# Altium schematic sheet Power_Supply.SCHDOC: Power Supply
size A3; ApprovedBy: zac1; Author: mmb1; DrawnBy: mmb1; Engineer: mmb1; Organization: Berne University of Applied Sciences; Address1: School of Engineering and; Address2: Information Technology; Address3: Quellgasse 21; Address4: CH-2501 Biel; Revision: 1.0; SheetNumber: 3; SheetTotal: 6
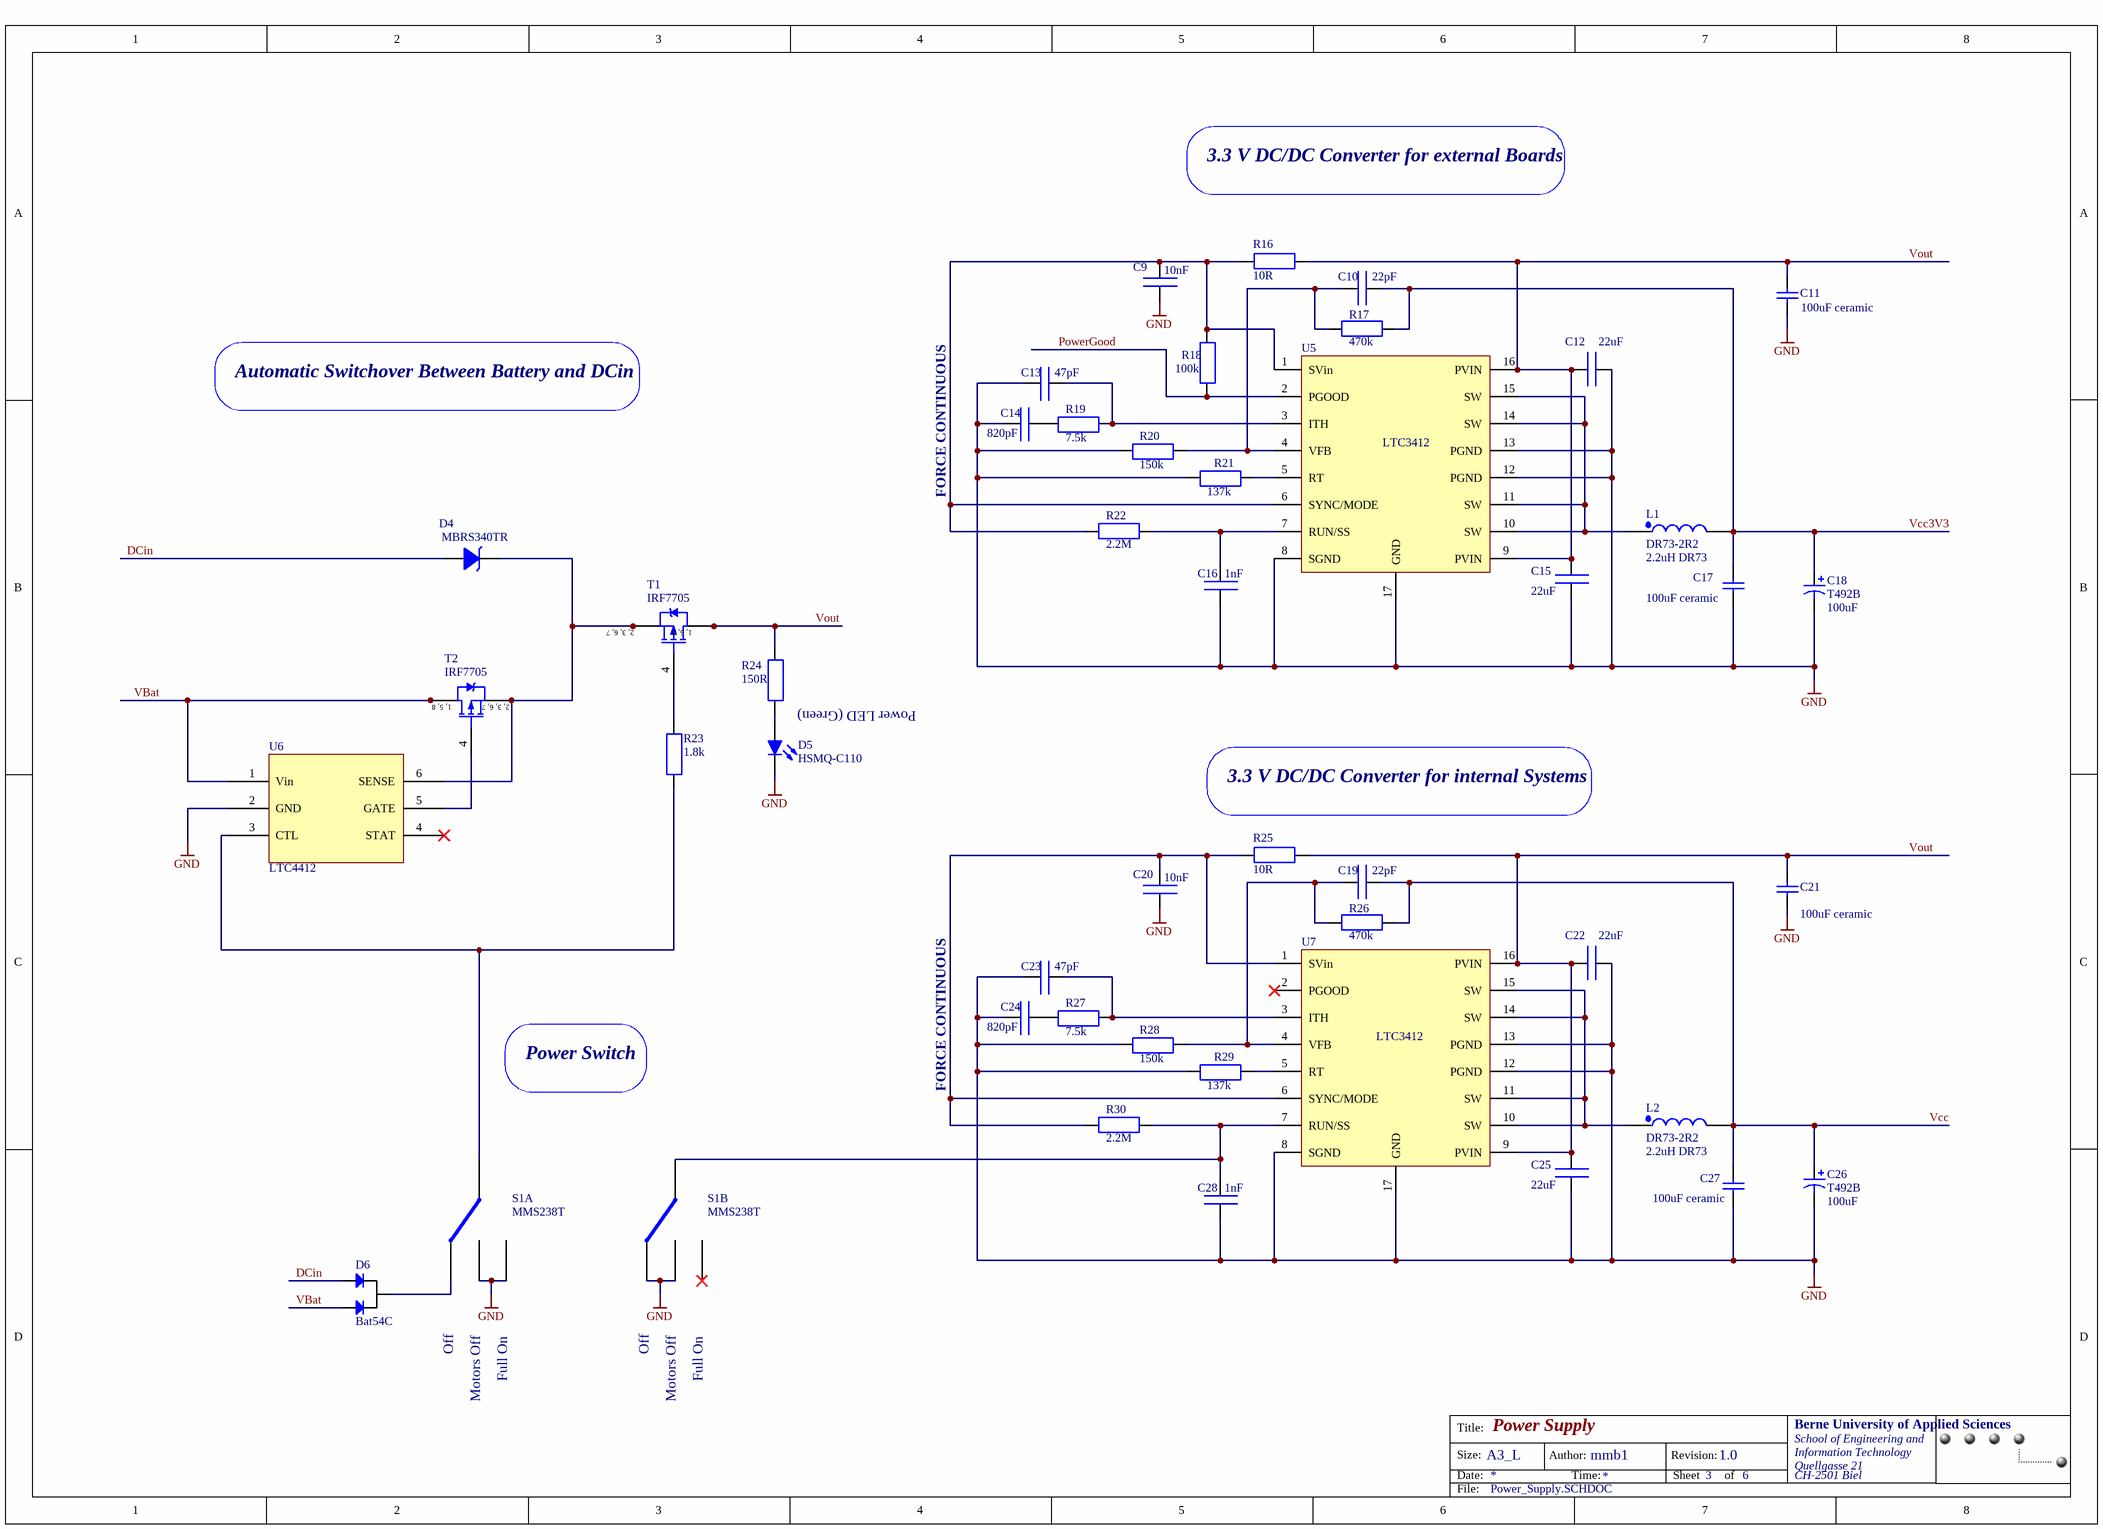
[diagram p0: Power_Supply.SCHDOC]

## Parts
C9  10nF  [1608[0603]]
C10  22pF  [1608[0603]]
C11  value 100uF ceramic  [C1210]  (hidden comment: Cap Semi)
C12  22uF  [C0805]
C13  47pF  [1608[0603]]
C14  820pF  [1608[0603]]
C15  22uF  [C0805]
C16  1nF  [1608[0603]]
C17  value 100uF ceramic  [C1210]  (hidden comment: Cap Semi)
C18  T492B  value 100uF  [B]
C19  22pF  [1608[0603]]
C20  10nF  [1608[0603]]
C21  value 100uF ceramic  [C1210]  (hidden comment: Cap Semi)
C22  22uF  [C0805]
C23  47pF  [1608[0603]]
C24  820pF  [1608[0603]]
C25  22uF  [C0805]
C26  T492B  value 100uF  [B]
C27  value 100uF ceramic  [C1210]  (hidden comment: Cap Semi)
C28  1nF  [1608[0603]]
D4  value MBRS340TR  [MBRS340]  (hidden comment: Schottky  Power Rectifier)
D5  HSMQ-C110  [HSMC-C110]
D6  Bat54C  [BAT54C]
L1  value 2.2uH DR73  [B82472G4222M]  (hidden comment: DR73-2R2)
L2  value 2.2uH DR73  [B82472G4222M]  (hidden comment: DR73-2R2)
R16  10R  [1608[0603]]
R17  470k  [1608[0603]]
R18  100k  [1608[0603]]
R19  7.5k  [1608[0603]]
R20  150k  [1608[0603]]
R21  137k  [1608[0603]]
R22  2.2M  [1608[0603]]
R23  1.8k  [1608[0603]]
R24  150R  [1608[0603]]
R25  10R  [1608[0603]]
R26  470k  [1608[0603]]
R27  7.5k  [1608[0603]]
R28  150k  [1608[0603]]
R29  137k  [1608[0603]]
R30  2.2M  [1608[0603]]
S1  MMS238T  [switch_mms238t]  (parts A,B of 2)
T1  IRF7705  [TSSOP-8]
T2  IRF7705  [TSSOP-8]
U5  LTC3412  [LCT3412A_New]
U6  LTC4412  [MAX5467]
U7  LTC3412  [LCT3412A_New]

## Nets
GND: C9.1(J1) C11.1 C12.1(J1) C13.1(J1) C14.1(J1) C15.1(J1) C16.1(J1) C17.1 C18.2 C20.1(J1) C21.1 C22.1(J1) C23.1(J1) C24.1(J1) C25.1(J1) C26.2 C27.1 C28.1(J1) D5.1(K) R20.1(J1) R21.1(J1) R28.1(J1) R29.1(J1) S1.3 S1.4 S1.6 S1.8 U5.8(SGND) U5.12(PGND) U5.13(PGND) U5.17(GND) U6.2(GND) U7.8(SGND) U7.12(PGND) U7.13(PGND) U7.17(GND)
DCin: D4.1(Anode) D6.2(A)
PowerGood: R18.1(J1) U5.2(PGOOD)
VBat: D6.1(A) T2.1(D) T2.5(D) T2.8(D) U6.1(Vin)
Vcc: C19.1(J1) C26.1 C27.2 L2.2 R26.1(J1)
Vcc3V3: C10.1(J1) C17.2 C18.1 L1.2 R17.1(J1)
Vout: C11.2 C12.2(J2) C15.2(J2) C21.2 C22.2(J2) C25.2(J2) R16.1(J1) R24.2(J2) R25.1(J1) T1.1(D) T1.5(D) T1.8(D) U5.9(PVIN) U5.16(PVIN) U7.9(PVIN) U7.16(PVIN)
NetC9_2: C9.2(J2) R16.2(J2) R18.2(J2) R22.2(J2) U5.1(SVin) U5.6(SYNC/MODE)
NetC10_2: C10.2(J2) R17.2(J2) R20.2(J2) U5.4(VFB)
NetC13_2: C13.2(J2) R19.2(J2) U5.3(ITH)
NetC14_2: C14.2(J2) R19.1(J1)
NetC16_2: C16.2(J2) R22.1(J1) U5.7(RUN/SS)
NetC19_2: C19.2(J2) R26.2(J2) R28.2(J2) U7.4(VFB)
NetC20_2: C20.2(J2) R25.2(J2) R30.2(J2) U7.1(SVin) U7.6(SYNC/MODE)
NetC23_2: C23.2(J2) R27.2(J2) U7.3(ITH)
NetC24_2: C24.2(J2) R27.1(J1)
NetC28_2: C28.2(J2) R30.1(J1) S1.7 U7.7(RUN/SS)
NetD4_2: D4.2(Cathode) T1.2(S) T1.3(S) T1.6(S) T1.7(S) T2.2(S) T2.3(S) T2.6(S) T2.7(S) U6.6(SENSE)
NetD5_2: D5.2(A) R24.1(J1)
NetD6_3: D6.3(K) S1.1
NetL1_1: L1.1 U5.10(SW) U5.11(SW) U5.14(SW) U5.15(SW)
NetL2_1: L2.1 U7.10(SW) U7.11(SW) U7.14(SW) U7.15(SW)
NetR21_2: R21.2(J2) U5.5(RT)
NetR23_1: R23.1(J1) S1.2 U6.3(CTL)
NetR23_2: R23.2(J2) T1.4(G)
NetR29_2: R29.2(J2) U7.5(RT)
NetT2_4: T2.4(G) U6.5(GATE)

Not connected (* = marked no-connect by the designer): S1 5*; U6 4(STAT)*; U7 2(PGOOD)*

## Notes on the sheet
- 3.3 V DC/DC Converter for external Boards
- Automatic Switchover Between Battery and DCin
- FORCE CONTINUOUS
- Power LED (Green)
- 3.3 V DC/DC Converter for internal Systems
- Power Switch
- Off
- Motors Off
- Full On
- Title:
- Size:
- Date:
- A3_L
- Author:
- Time:
- Revision:
- Sheet
- of
- File:
- (in symbol IRF7705) 1, 5, 8; 2, 3, 6, 7

## Library data of the parts
C9 C20 = CAP: Capacitor; Manufacturer: AVX; Part Number: 06035C103KAT2A; Value: 10nF 0603; Currency: CHF; Packaging unit: 10; Part Type: 10nF; Distributor: Farnell; Distributor Number: 1327 675; Price: 0.07; RoHS: yes
C10 C19 = CAP: Capacitor; Manufacturer: Epcos; Part Number: B37930K5220J60; Value: 22pF 0603; Currency: CHF; Packaging unit: 10; Part Type: 22pF; Distributor: Farnell; Distributor Number: 9753 486; Price: 0.083; RoHS: yes
C11 C17 C21 C27 = Cap Semi: Capacitor (Semiconductor SIM Model); Manufacturer: Kemet; Part Number: C1210C107M9PAC7800; Currency: CHF; Packaging unit: 1; Published: 8-Jun-2000; LatestRevisionDate: 17-Jul-2002; LatestRevisionNote: Re-released for DXP Platform.; Publisher: Altium Limited; Distributor: Farnell; Distributor Number: 1108 328; Price: 4.13; RoHS: yes
C12 C15 C22 C25 = CAP: Capacitor; Manufacturer: Kemet; Part Number: C0805C226M9PAC7800; Value: 22uF 0805; Currency: CHF; Packaging unit: 1; Distributor: Farnell; Distributor Number: 1108 326; Price: 1.8; RoHS: yes
C13 C23 = CAP: Capacitor; Manufacturer: Murata; Part Number: GRM1885C1H470JA01D; Value: 47pF 0603; Currency: CHF; Packaging unit: 10; Part Type: 47pF; Distributor: Farnell; Distributor Number: 8819 840; Price: 0.071; RoHS: yes
C14 C24 = CAP: Capacitor; Manufacturer: PHYCOMP; Part Number: 2238 861 15821; Value: 820pF 0603; Currency: CHF; Packaging unit: 10; Part Type: 820pF; Distributor: Farnell; Distributor Number: 718 555; Price: 0.115; RoHS: yes
C16 C28 = CAP: Capacitor; Manufacturer: Murata; Part Number: GRM188R71H102KA01D; Value: 1nF 0603; Currency: CHF; Packaging unit: 10; Part Type: 1nF; Distributor: Farnell; Distributor Number: 8819 955; Price: 0.071; RoHS: yes
C18 C26 = T492B: Solid Tantalum Chip Capacitor, T492 Series - CWR11 Style Per Mil-PRF-55365/8; Manufacturer: AVX; Part Number: TCJB107M004R0070; Currency: CHF; Packaging unit: 1; Published: 17-Jul-2002; LatestRevisionDate: 19-Mar-2004; LatestRevisionNote: Silkscreen dimensions re-sized.; Publisher: Altium Limited; Distributor: Farnell; Distributor Number: 1135 228; Price: 0.98; RoHS: yes
D4 = shottky-mbrs340tr: Manufacturer: Vishay; Part Number: MBRS340TRPBF; Currency: CHF; Packaging unit: 1; Distributer: Farnell; Part Type: Schottky  Power Rectifier; Distributor: Farnell; Distributor Number: 1463 234; Price: 0.617; RoHS: yes
D5 = LED-HSM*-C110: LED; Manufacturer: Avago; Value: side led green; Currency: CHF; Packaging unit: 5; Revision: July-2002: Re-released for DXP Platform.; Part Type: HSMQ-C110; Distributor: Farnell; Distributor Number: 8554 692; Part Number: HSMQ-C110; Price: 1.8; RoHS: yes
D6 = BAT54C: Manufacturer: ST; Part Number: BAT54CFILM; Currency: CHF; lead time: 2 Weeks; Packaging unit: 1; Part Type: Bat54C; Value: BAT54C; Distributor: Farnell; Distributor Number: 1261 334; Price: 0.13; RoHS: yes
L1 L2 = COIL-DR-SERIE: DR Series Coils from Coiltronics; Manufacturer: Cooper Bussmann; Currency: CHF; Packaging unit: 1; Part Type: DR73-2R2; Distributor: Farnell; Distributor Number: 1463 507; Part Number: DR73-2R2; RoHS: yes; Price: 2
R16 R25 = RES: Resistance; Manufacturer: Multicomp; Part Number: MC 0.063W 0603 1% 10R; Value: 10R 0603; Currency: CHF; Packaging unit: 50; Part Type: 10R; Distributor: Farnell; Distributor Number: 9330 429; RoHS: X-yes; Price: 0.062
R17 R26 = RES: Resistance; Manufacturer: Multicomp; Part Number: MC 0.063W 0603 1% 470K; Value: 470k 0603; Currency: CHF; Packaging unit: 50; Part Type: 470k; Distributor: Farnell; Distributor Number: 9331 263; RoHS: X-yes; Price: 0.034
R18 = RES: Resistance; Manufacturer: Multicomp; Part Number: MC 0.063W 0603 1% 100K; Value: 100k 0603; Currency: CHF; Packaging unit: 50; Part Type: 100k; Distributor: Farnell; Distributor Number: 9330 402; RoHS: X-yes; Price: 0.062
R19 R27 = RES: Resistance; Manufacturer: Multicomp; Part Number: MC 0.063W 0603 1% 7K5; Value: 7.5k 0603; Currency: CHF; Packaging unit: 50; Part Type: 7.5k; Distributor: Farnell; Distributor Number: 9331 514; RoHS: X-yes; Price: 0.062
R20 R28 = RES: Resistance; Manufacturer: Multicomp; Part Number: MC 0.063W 0603 1% 150K; Value: 150k 0603; Currency: CHF; Packaging unit: 50; Part Type: 150k; Distributor: Farnell; Distributor Number: 9330 623; RoHS: X-yes; Price: 0.034
R21 R29 = RES: Resistance; Manufacturer: Multicomp; Part Number: MC 0.063W 0603 1% 137K; Value: 137k 0603; Currency: CHF; Packaging unit: 50; Part Type: 137k; Distributor: Farnell; Distributor Number: 1170 999; RoHS: X-yes; Price: 0.034
R22 R30 = RES: Resistance; Manufacturer: PHYCOMP; Part Number: 232270462205; Value: 2.2M 0603; Currency: CHF; Packaging unit: 50; Part Type: 2.2M; Distributor: Farnell; Distributor Number: 9238 883; RoHS: yes; Price: 0.122
R23 = RES: Resistance; Manufacturer: Multicomp; Part Number: MC 0.063W 0603 1% 1K8; Value: 1.8k 0603; Currency: CHF; Packaging unit: 50; Part Type: 1.8k; Distributor: Farnell; Distributor Number: 9330 712; Price: 0.062; RoHS: X-yes
R24 = RES: Resistance; Manufacturer: Multicomp; Part Number: MC 0.063W 0603 1% 150R; Value: 150R 0603; Currency: CHF; Packaging unit: 50; Part Type: 150R; Distributor: Farnell; Distributor Number: 9330 593; RoHS: X-yes; Price: 0.062
S1 = switch-mms238T: Manufacturer: KNITTER; Currency: CHF; Packaging unit: 1; Part Type: MMS238T; Value: MMS 238 T; Distributor: Farnell; Distributor Number: 8546 827; Part Number: MMS 238 T; RoHS: yes; Price: 3.35
T1 T2 = IRF7705: HEXFET Power MOSFET; Manufacturer: IRF; Part Number: IRF7705TRPBF; Currency: CHF; Packaging unit: 1; Published: 17-Sep-2003; LatestRevisionDate: 04-Mar-2005; LatestRevisionNote: Stylized 3D Model Added.; DatasheetVersion: 5-Jun-2001; PackageVersion: Jun-2000; Publisher: Altium Limited; PackageDescription: Shrink Small Outline; 8 Leads; Body Width 4.4 mm; Pitch 0.65 mm; Value: IRF7705; Distributor: Farnell; Distributor Number: 1298 533; Price: 3.65; RoHS: yes
U5 U7 = LTC3412A_NEW: Manufacturer: Linear; Part Number: LTC3412AEFE#PBF; Value: LTC3412AEFE; Currency: $; lead time: 2 Weeks; Packaging unit: 2; Distributor: Linear online; Distributor Number: LTC3412AEFE#PBF; RoHS: yes; Price: 4.93
U6 = LTC4412: Manufacturer: Linear; Part Number: LTC4412ES6#PBF; Currency: $; lead time: 2 Weeks; Packaging unit: 2; Value: LTC4412; Distributor: Linear online; Distributor Number: LTC4412ES6#PBF; RoHS: yes; Price: 1.93